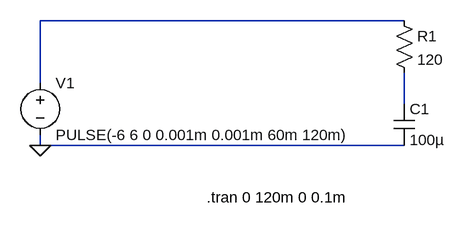
[diagram p0: schematic Draft1.asc]
Draft1.asc, the LTspice schematic file:
Version 4.1
SHEET 1 880 680
WIRE 464 -16 -96 -16
WIRE -96 80 -96 -16
WIRE 464 112 464 64
WIRE -96 176 -96 160
WIRE 464 176 -96 176
FLAG -96 176 0
SYMBOL voltage -96 64 R0
WINDOW 123 0 0 Left 0
WINDOW 39 0 0 Left 0
SYMATTR InstName V1
SYMATTR Value PULSE(-6 6 0 0.001m 0.001m 60m 120m)
SYMBOL cap 448 112 R0
SYMATTR InstName C1
SYMATTR Value 100µ
SYMBOL res 448 -32 R0
SYMATTR InstName R1
SYMATTR Value 120
TEXT 160 256 Left 2 !.tran 0 120m 0 0.1m

The netlist it stands for:
* Draft1.asc
V1 N001 0 PULSE(-6 6 0 0.001m 0.001m 60m 120m)
C1 N002 0 100µ
R1 N001 N002 120
.tran 0 120m 0 0.1m
.backanno
.end